# EAGLE schematic Telemetry Unit (EAGLE 9.4.2)

## Sheet 1 of 5: ATMega128 Microcontroller
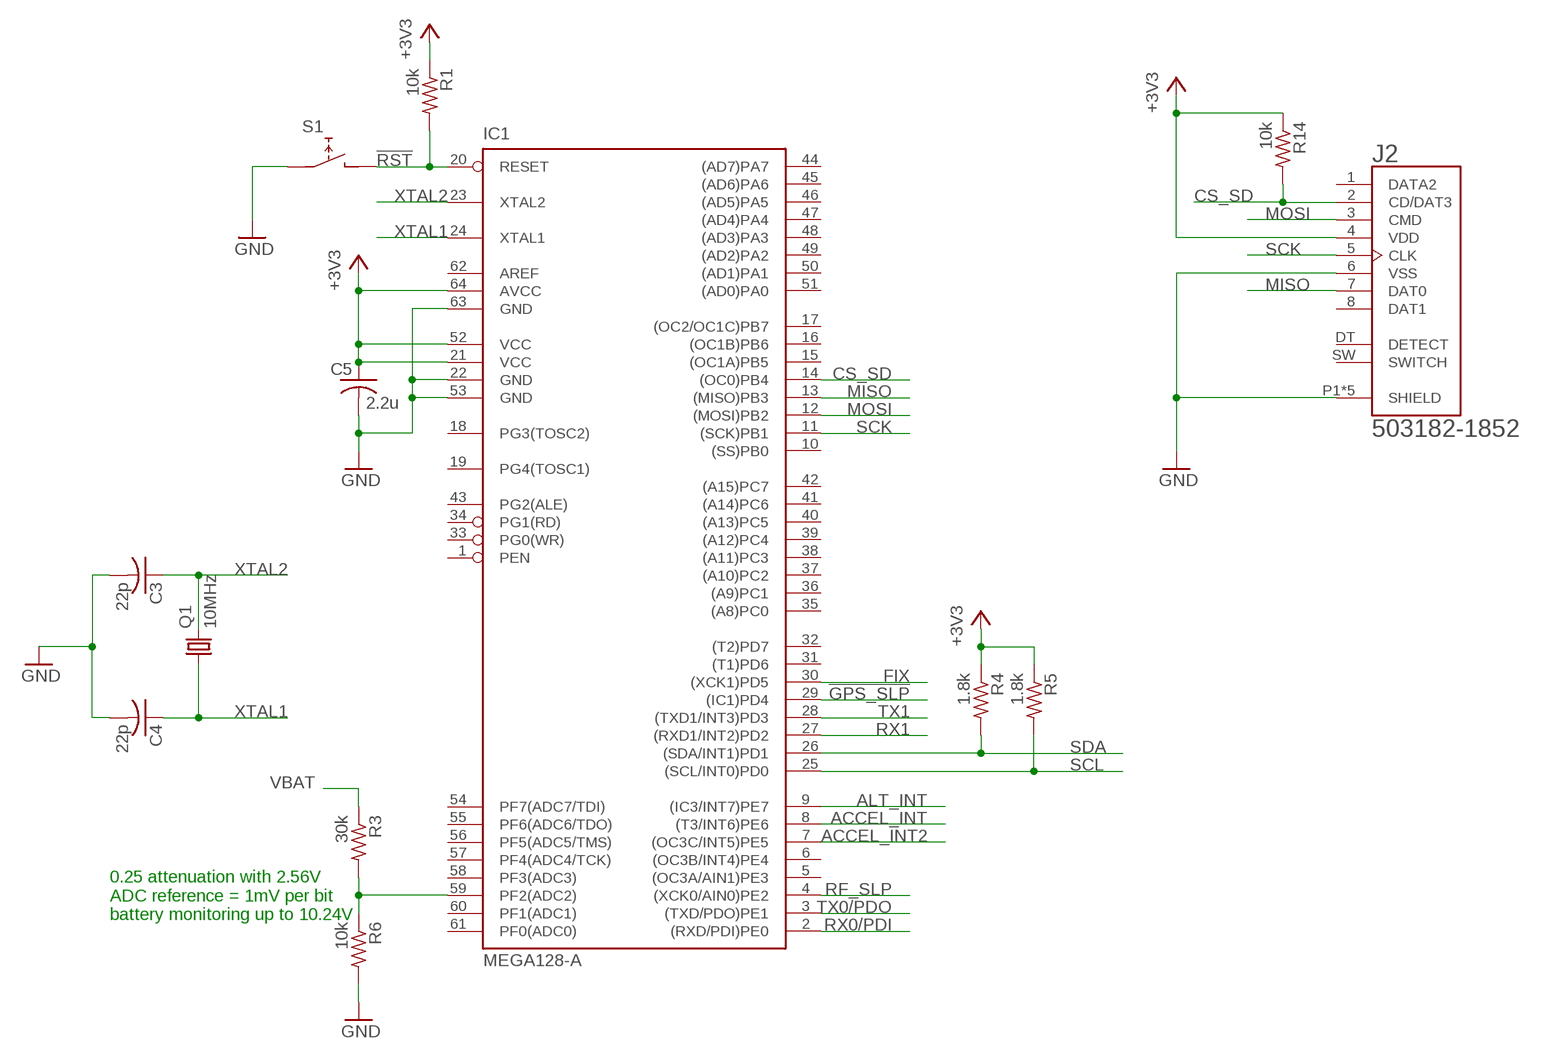
[diagram p0: schematic, sheet 1]

### Parts
C3  22p  C-USC0603  [C0603]
C4  22p  C-USC0603  [C0603]
C5  2.2u  C-USC0603  [C0603]
IC1  MEGA128-A  [TQFP64]
J2  503182-1852  [MOLEX_503182-1852]
Q1  10MHz  KX-7  [3.2X2.5_KX-7]
R1  10k  R-US_R0603  [R0603]
R3  30k  R-US_R0603  [R0603]
R4  1.8k  R-US_R0603  [R0603]
R5  1.8k  R-US_R0603  [R0603]
R6  10k  R-US_R0603  [R0603]
R14  10k  R-US_R0603  [R0603]
S1  TACT_SW_4.5MM  [TACT_SW_4.5MM]

### Nets
!GPS_SLP: IC1.29((IC1)PD4) ; also sheet 2
!RST: IC1.20(RESET) R1.2 S1.P2@1 S1.P2@2 ; also sheet 4
+3V3: C5.1 IC1.21(VCC) IC1.52(VCC) IC1.64(AVCC) J2.4(VDD) R1.1 R4.1 R5.1 R14.1 ; also sheet 2,3,4,5
ACCEL_INT: IC1.8((T3/INT6)PE6) ; also sheet 3
ACCEL_INT2: IC1.7((OC3C/INT5)PE5) ; also sheet 3
ALT_INT: IC1.9((IC3/INT7)PE7) ; also sheet 3
CS_SD: IC1.14((OC0)PB4) J2.2(CD/DAT3) R14.2
FIX: IC1.30((XCK1)PD5) ; also sheet 2
GND: C3.2 C4.2 C5.2 IC1.22(GND) IC1.53(GND) IC1.63(GND) J2.6(VSS) J2.P1(SHIELD) J2.P2(SHIELD) J2.P3(SHIELD) J2.P4(SHIELD) J2.P5(SHIELD) R6.2 S1.P1@1 S1.P1@2 ; also sheet 2,3,4,5
MISO: IC1.13((MISO)PB3) J2.7(DAT0)
MOSI: IC1.12((MOSI)PB2) J2.3(CMD)
N$5: IC1.59(PF2(ADC2)) R3.2 R6.1
RF_SLP: IC1.4((XCK0/AIN0)PE2) ; also sheet 4
RX0/PDI: IC1.2((RXD/PDI)PE0) ; also sheet 4
RX1: IC1.27((RXD1/INT2)PD2) ; also sheet 2
SCK: IC1.11((SCK)PB1) J2.5(CLK) ; also sheet 4
SCL: IC1.25((SCL/INT0)PD0) R5.2 ; also sheet 3
SDA: IC1.26((SDA/INT1)PD1) R4.2 ; also sheet 3
TX0/PDO: IC1.3((TXD/PDO)PE1) ; also sheet 4
TX1: IC1.28((TXD1/INT3)PD3) ; also sheet 2
VBAT: R3.1 ; also sheet 5
XTAL1: C4.1 IC1.24(XTAL1) Q1.1
XTAL2: C3.1 IC1.23(XTAL2) Q1.3
Unconnected: IC1.1(PEN) IC1.5((OC3A/AIN1)PE3) IC1.6((OC3B/INT4)PE4) IC1.10((SS)PB0) IC1.15((OC1A)PB5) IC1.16((OC1B)PB6) IC1.17((OC2/OC1C)PB7) IC1.18(PG3(TOSC2)) IC1.19(PG4(TOSC1)) IC1.31((T1)PD6) IC1.32((T2)PD7) IC1.33(PG0(WR)) IC1.34(PG1(RD)) IC1.35((A8)PC0) IC1.36((A9)PC1) IC1.37((A10)PC2) IC1.38((A11)PC3) IC1.39((A12)PC4) IC1.40((A13)PC5) IC1.41((A14)PC6) IC1.42((A15)PC7) IC1.43(PG2(ALE)) IC1.44((AD7)PA7) IC1.45((AD6)PA6) IC1.46((AD5)PA5) IC1.47((AD4)PA4) IC1.48((AD3)PA3) IC1.49((AD2)PA2) IC1.50((AD1)PA1) IC1.51((AD0)PA0) IC1.54(PF7(ADC7/TDI)) IC1.55(PF6(ADC6/TDO)) IC1.56(PF5(ADC5/TMS)) IC1.57(PF4(ADC4/TCK)) IC1.58(PF3(ADC3)) IC1.60(PF1(ADC1)) IC1.61(PF0(ADC0)) IC1.62(AREF) J2.1(DATA2) J2.8(DAT1) J2.DT(DETECT) J2.SW(SWITCH)

### Notes on the sheet
- 0.25 attenuation with 2.56V
  ADC reference = 1mV per bit
  battery monitoring up to 10.24V

## Sheet 2 of 5: GPS Module
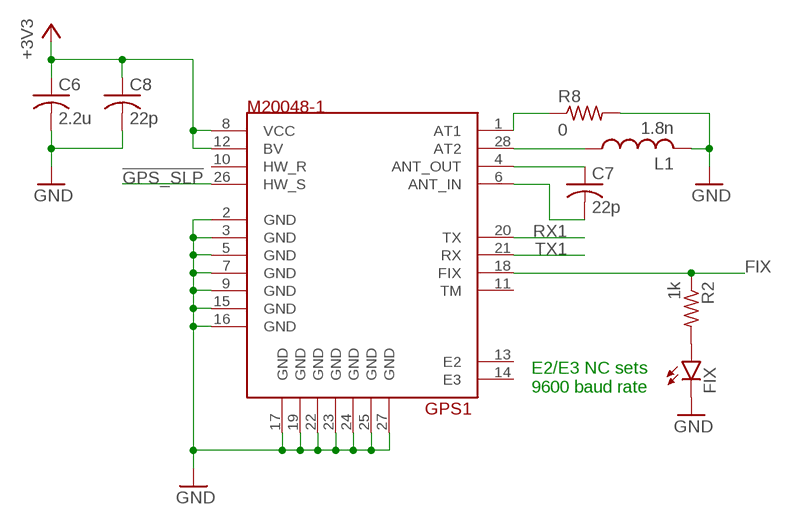
[diagram p1: schematic, sheet 2]

### Parts
C6  2.2u  C-USC0603  [C0603]
C7  22p  C-USC0603  [C0603]
C8  22p  C-USC0603  [C0603]
FIX  LEDCHIP-LED0603  [CHIP-LED0603]
GPS1  M20048-1  [M20048-1]
L1  1.8n  L_SMALLL0603  [L0603]
R2  1k  R-US_R0603  [R0603]
R8  0  R-US_R0603  [R0603]

### Nets
!GPS_SLP: GPS1.26(HW_S) ; also sheet 1
+3V3: C6.1 C8.1 GPS1.8(VCC) GPS1.12(BV) ; also sheet 1,3,4,5
FIX: GPS1.18(FIX) R2.1 ; also sheet 1
GND: C6.2 C8.2 FIX.C GPS1.2(GND) GPS1.3(GND) GPS1.5(GND) GPS1.7(GND) GPS1.9(GND) GPS1.15(GND) GPS1.16(GND) GPS1.17(GND) GPS1.19(GND) GPS1.22(GND) GPS1.23(GND) GPS1.24(GND) GPS1.25(GND) GPS1.27(GND) L1.2 R8.2 ; also sheet 1,3,4,5
N$1: C7.1 GPS1.4(ANT_OUT)
N$3: C7.2 GPS1.6(ANT_IN)
N$4: GPS1.28(AT2) L1.1
N$6: FIX.A R2.2
N$21: GPS1.1(AT1) R8.1
RX1: GPS1.20(TX) ; also sheet 1
TX1: GPS1.21(RX) ; also sheet 1
Unconnected: GPS1.10(HW_R) GPS1.11(TM) GPS1.13(E2) GPS1.14(E3)

### Notes on the sheet
- E2/E3 NC sets
  9600 baud rate

## Sheet 3 of 5: Misc Sensing
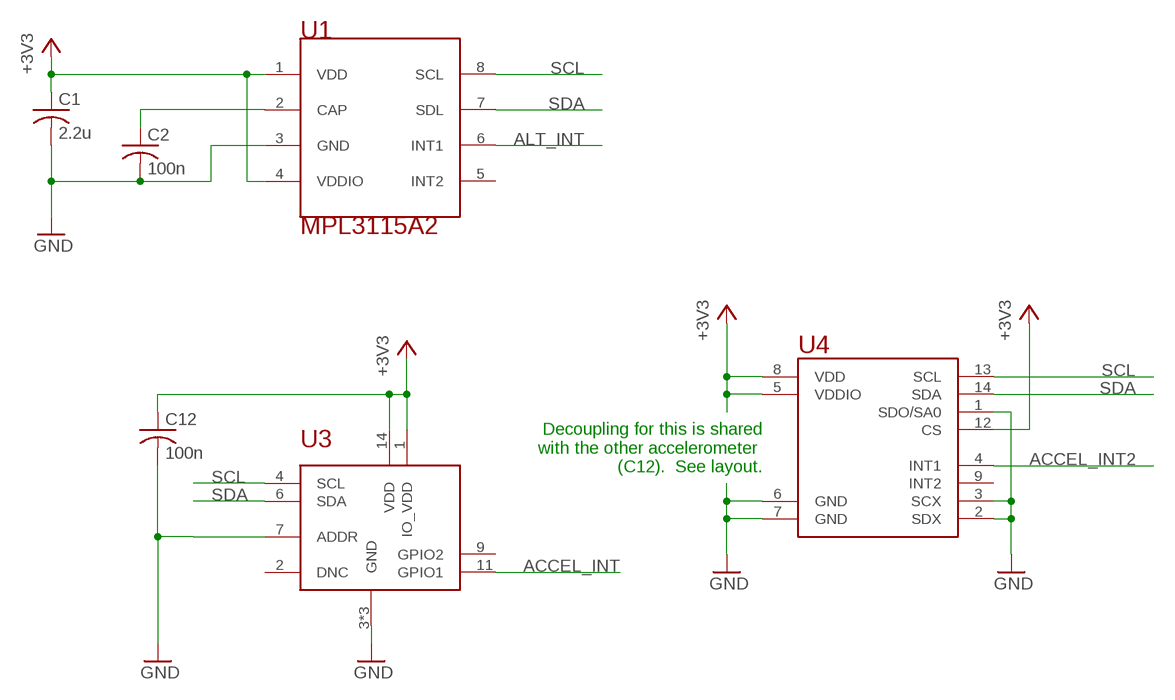
[diagram p2: schematic, sheet 3]

### Parts
C1  2.2u  C-USC0603  [C0603]
C2  100n  C-USC0603  [C0603]
C12  100n  C-USC0603  [C0603]
U1  MPL3115A2  [LGA8]
U3  KMX63-1055  [LGA16_3X3]
U4  LSM6DS3  [14-LGA]

### Nets
+3V3: C1.1 C12.1 U1.1(VDD) U1.4(VDDIO) U3.1(IO_VDD) U3.14(VDD) U4.5(VDDIO) U4.8(VDD) U4.12(CS) ; also sheet 1,2,4,5
ACCEL_INT: U3.11(GPIO1) ; also sheet 1
ACCEL_INT2: U4.4(INT1) ; also sheet 1
ALT_INT: U1.6(INT1) ; also sheet 1
GND: C1.2 C2.2 C12.2 U1.3(GND) U3.3(GND) U3.5(GND) U3.7(ADDR) U3.12(GND) U4.1(SDO/SA0) U4.2(SDX) U4.3(SCX) U4.6(GND) U4.7(GND) ; also sheet 1,2,4,5
N$2: C2.1 U1.2(CAP)
SCL: U1.8(SCL) U3.4(SCL) U4.13(SCL) ; also sheet 1
SDA: U1.7(SDL) U3.6(SDA) U4.14(SDA) ; also sheet 1
Unconnected: U1.5(INT2) U3.2(DNC) U3.9(GPIO2) U4.9(INT2)

### Notes on the sheet
- Decoupling for this is shared
  with the other accelerometer 
  (C12).  See layout.

## Sheet 4 of 5: XBee/Programmer
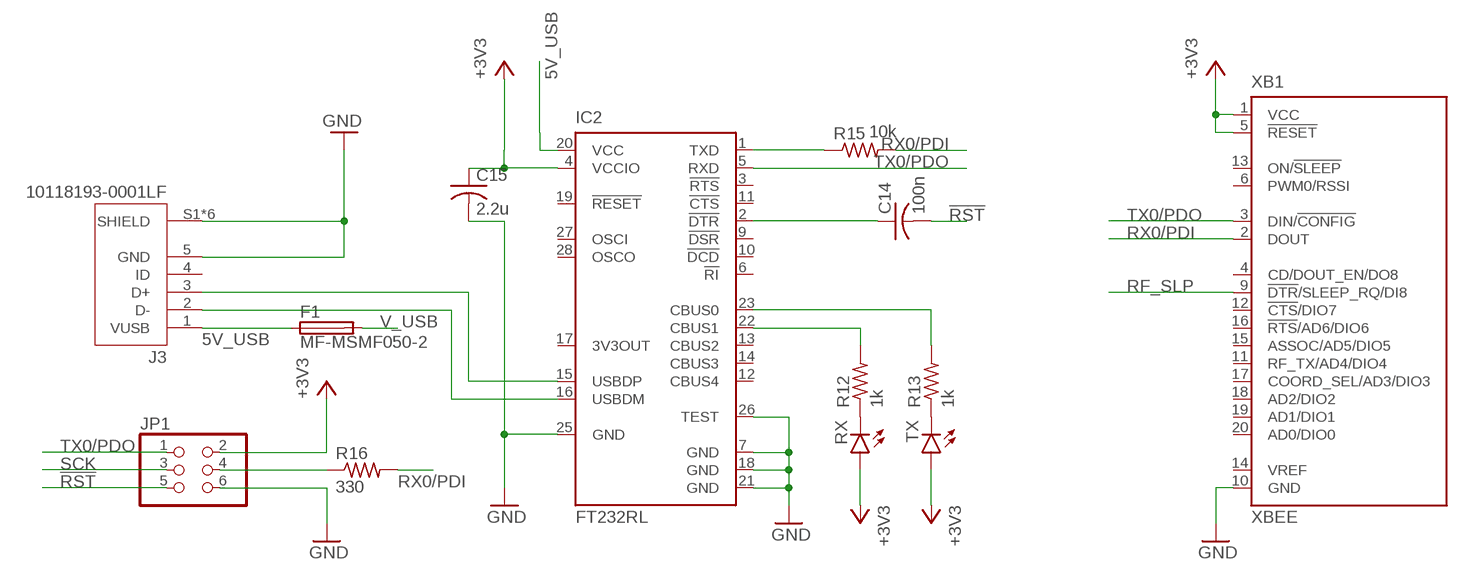
[diagram p3: schematic, sheet 4]

### Parts
C14  100n  C-USC0603  [C0603]
C15  2.2u  C-USC0603  [C0603]
F1  MF-MSMF050-2  [FUSM1812X02]
IC2  FT232RL  [SSOP28]
J3  10118193-0001LF  [FCI_10118193-0001LF]
JP1  PINHD-2X3  [2X03]
R12  1k  R-US_R0603  [R0603]
R13  1k  R-US_R0603  [R0603]
R15  10k  R-US_R0603  [R0603]
R16  330  R-US_R0603  [R0603]
RX  LEDCHIP-LED0603  [CHIP-LED0603]
TX  LEDCHIP-LED0603  [CHIP-LED0603]
XB1  XBEE  [XBEE]

### Nets
5V_USB: F1.1 IC2.20(VCC) J3.1(VUSB)
!RST: C14.2 JP1.5 ; also sheet 1
+3V3: C15.1 IC2.4(VCCIO) JP1.2 RX.A TX.A XB1.1(VCC) XB1.5(!RESET) ; also sheet 1,2,3,5
GND: C15.2 IC2.7(GND) IC2.18(GND) IC2.21(GND) IC2.25(GND) IC2.26(TEST) J3.5(GND) J3.S1(SHIELD) J3.S2(SHIELD) J3.S3(SHIELD) J3.S4(SHIELD) J3.S5(SHIELD) J3.S6(SHIELD) JP1.6 XB1.10(GND) ; also sheet 1,2,3,5
N$11: IC2.16(USBDM) J3.2(D-)
N$13: IC2.15(USBDP) J3.3(D+)
N$15: R12.1 RX.C
N$16: C14.1 IC2.2(!DTR)
N$17: R13.1 TX.C
N$18: IC2.22(CBUS1) R12.2
N$19: IC2.23(CBUS0) R13.2
N$20: IC2.1(TXD) R15.1
PDI: JP1.4 R16.1
RF_SLP: XB1.9(!DTR!/SLEEP_RQ/DI8) ; also sheet 1
RX0/PDI: R15.2 R16.2 XB1.2(DOUT) ; also sheet 1
SCK: JP1.3 ; also sheet 1
TX0/PDO: IC2.5(RXD) JP1.1 XB1.3(DIN/!CONFIG) ; also sheet 1
V_USB: F1.2 ; also sheet 5
Unconnected: IC2.3(!RTS) IC2.6(!RI) IC2.9(!DSR) IC2.10(!DCD) IC2.11(!CTS) IC2.12(CBUS4) IC2.13(CBUS2) IC2.14(CBUS3) IC2.17(3V3OUT) IC2.19(!RESET) IC2.27(OSCI) IC2.28(OSCO) J3.4(ID) XB1.4(CD/DOUT_EN/DO8) XB1.6(PWM0/RSSI) XB1.11(RF_TX/AD4/DIO4) XB1.12(!CTS!/DIO7) XB1.13(ON/!SLEEP) XB1.14(VREF) XB1.15(ASSOC/AD5/DIO5) XB1.16(!RTS!/AD6/DIO6) XB1.17(COORD_SEL/AD3/DIO3) XB1.18(AD2/DIO2) XB1.19(AD1/DIO1) XB1.20(AD0/DIO0)

## Sheet 5 of 5: Power Supply
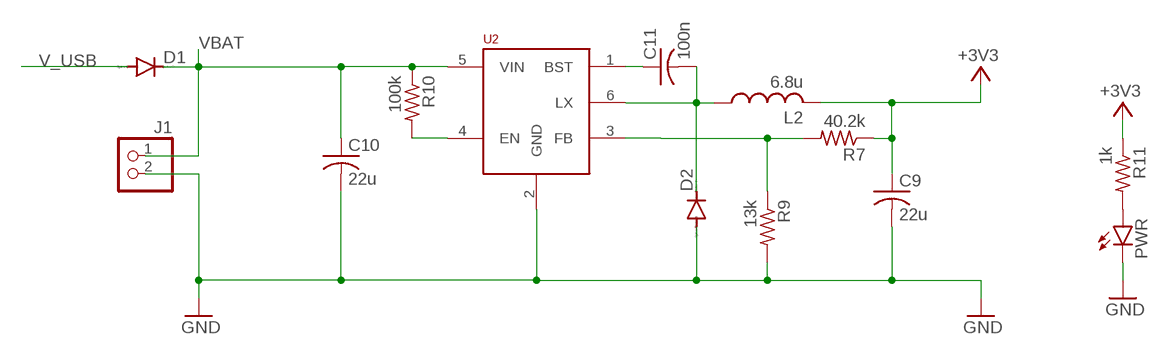
[diagram p4: schematic, sheet 5]

### Parts
C9  22u  C-USC0805  [C0805]
C10  22u  C-USC0805  [C0805]
C11  100n  C-USC0603  [C0603]
D1  DIODE-SOD123  [SOD123]
D2  DIODE-SOD123  [SOD123]
J1  ST_2X1  [ST_2X1]
L2  6.8u  L_SMALLL1210  [L1210]
PWR  LEDCHIP-LED0603  [CHIP-LED0603]
R7  40.2k  R-US_R0603  [R0603]
R9  13k  R-US_R0603  [R0603]
R10  100k  R-US_R0603  [R0603]
R11  1k  R-US_R0603  [R0603]
U2  AOZ1280  [TSOT23-6]

### Nets
+3V3: C9.1 L2.2 R7.1 R11.1 ; also sheet 1,2,3,4
GND: C9.2 C10.2 D2.A J1.2 PWR.C R9.2 U2.2(GND) ; also sheet 1,2,3,4
N$7: C11.2 D2.C L2.1 U2.6(LX)
N$9: R10.2 U2.4(EN)
N$10: R7.2 R9.1 U2.3(FB)
N$12: C11.1 U2.1(BST)
N$14: PWR.A R11.2
V_USB: D1.A ; also sheet 4
VBAT: C10.1 D1.C J1.1 R10.1 U2.5(VIN) ; also sheet 1

## Library data of the parts
C1-C12 C14 C15 = resistor:C-US: CAPACITOR, American symbol
D1 D2 = diode:DIODE-: DIODE
F1 = MF-MSMF050-2:MF-MSMF050-2: PTC Resettable Fuse 0.5A(hold) 1A(trip) 15V 100A 0.8W 0.15s 0.15Ohm SMD Solder Pad 1812 T/R; AVAILABILITY: Unavailable; DESCRIPTION: PTC Resettable Fuse 0.5A_hold_ 1A_trip_ 15V 100A 0.8W 0.15s 0.15Ohm SMD Solder Pad 1812 T/R; MF: Bourns; MP: MF-MSMF050-2; PACKAGE: 1812 Bourns; PRICE: None
FIX PWR RX TX = led:LED: LED OSRAM: - CHIPLED LG R971, LG N971, LY N971, LG Q971, LY Q971, LO R971, LY R971 LH N974, LH R974 LS Q976, LO Q976, LY Q976 LO Q996 - Hyper CHIPLED LW Q18S LB Q993, LB Q99A, LB R99A - SideLED LS A670, LO A670, LY A670, LG A670, LP A670 LB A673, LV A673, LT A673, LW A673 LH A674 LY A675 LS A676, LA A676, LO A676, LY A676, LW A676 LS A679, LY A679, LG A679 - Hyper Micro SIDELED® LS Y876, LA Y876, LO Y876, LY Y876 LT Y87S - SmartLED LW L88C, LW L88S LB L89C, LB L89S, LG L890 LS L89K, LO L89K, LY L89K LS L896, LA L896, LO L896, LY L896 - TOPLED LS T670, LO T670, LY T670, LG T670, LP T670 LSG T670, LSP T670, LSY T670, LOP T670, LYG T670 LG T671, LOG T671, LSG T671 LB T673, LV T673, LT T673, LW T673 LH T674 LS T676, LA T676, LO T676, LY T676, LB T676, LH T676, LSB T676, LW T676 LB T67C, LV T67C, LT T67C, LS T67K, LO T67K, LY T67K, LW E67C LS E67B, LA E67B, LO E67B, LY E67B, LB E67C, LV E67C, LT E67C LW T67C LS T679, LY T679, LG T679 LS T770, LO T770, LY T770, LG T770, LP T770 LB T773, LV T773, LT T773, LW T773 LH T774 LS E675, LA E675, LY E675, LS T675 LS T776, LA T776, LO T776, LY T776, LB T776 LHGB T686 LT T68C, LB T68C - Hyper Mini TOPLED® LB M676 - Mini TOPLED Santana® LG M470 LS M47K, LO M47K, LY M47K Source: http://www.osram.convergy.de LUXEON: - LUMILED® LXK2-PW12-R00, LXK2-PW12-S00, LXK2-PW14-U00, LXK2-PW14-V00 LXK2-PM12-R00, LXK2-PM12-S00, LXK2-PM14-U00 LXK2-PE12-Q00, LXK2-PE12-R00, LXK2-PE12-S00, LXK2-PE14-T00, LXK2-PE14-U00 LXK2-PB12-K00, LXK2-PB12-L00, LXK2-PB12-M00, LXK2-PB14-N00, LXK2-PB14-P00, LXK2-PB14-Q00 LXK2-PR12-L00, LXK2-PR12-M00, LXK2-PR14-Q00, LXK2-PR14-R00 LXK2-PD12-Q00, LXK2-PD12-R00, LXK2-PD12-S00 LXK2-PH12-R00, LXK2-PH12-S00 LXK2-PL12-P00, LXK2-PL12-Q00, LXK2-PL12-R00 Source: www.luxeon.com KINGBRIGHT: KA-3528ASYC Source: www.kingbright.com
GPS1 = TrackerPeripherals:M20048-1
IC1 = atmel:MEGA128: MICROCONTROLLER 128 Kbytes FLASH 4 Kbytes SRAM 4 Kbytes EEPROM DUAL USART 8-channel 10 bit ADC Source: avr.lbr; MPN: ATMEGA128-16AU; OC_FARNELL: 9171118; OC_NEWARK: 95K7364
IC2 = ftdichip:FT232R: Source: http://www.ftdichip.com/Documents/DataSheets/DS_FT232R_v104.pdf; MPN: FT232RL; OC_FARNELL: 1146032; OC_NEWARK: 91K9918
J1 = TrackerPeripherals:ST_2X1
J2 = 503182-1852_SD:503182-1852: Conn Micro SD Card M 8 POS 1.09mm Solder RA SMD Embossed T/R 0.5A/Contact; DESCRIPTION: MICRO SD NORMAL ULTRALOWPRO8CKTE; DIGI-KEY_PART_NUMBER: WM12834CT-ND; DIGI-KEY_PURCHASE_URL: https://www.digikey.com/product-detail/en/molex/5031821852/WM12834CT-ND/5823232?utm_source=snapeda&utm_medium=aggregator&utm_campaign=symbol; MF: Molex, LLC; MP: 5031821852; PACKAGE: None
J3 = 10118193-0001LF_microUSB:10118193-0001LF: Micro USB B Type Receptacle; DESCRIPTION: Conn Micro USB Type B RCP 5 POS 0.65mm Solder RA SMD 5 Terminal 1 Port T/R; DIGI-KEY_PART_NUMBER: 609-4616-1-ND; DIGI-KEY_PURCHASE_URL: https://www.digikey.com/product-detail/en/amphenol-icc-fci/10118193-0001LF/609-4616-1-ND/2785380?utm_source=snapeda&utm_medium=aggregator&utm_campaign=symbol; MF: Amphenol ICC; MP: 10118193-0001LF; PACKAGE: None
JP1 = pinhead:PINHD-2X3: PIN HEADER
L1 L2 = TrackerPeripherals:L_SMALL
Q1 = crystal-geyer_V1_0:KX: Quartz Crystals (MHz) SMD: KX - Serie Model Size l/w/h [mm] Frequency Range Frequency Stability Temp. Range [°C] Load Capacitance AECQ 200 availabel Datasheet KX-4 KX-5 KX-6 KX-7 KX-9A KX-9B KX-12A KX-12B KX-13 KX-20 KX-K KX-KS 1.6/1.2/0.3 2.0/1.6/0.45 2.5/2.0/0.55 3.2/2.5/0.8 5.0/3.2/1.0 5.0/3.2/1.1 6.0/3.5/1.1 6.0/3.5/1.0 7.0/5.0 /1.3 11.6/5.5/1.6 12.3/4.5/4.2 12.3/4.5/3.2 24.0 ~ 80.0 MHz 16.0 ~ 80.0 MHz 12.0 ~ 80.0 MHz 8.0 ~ 60.0 MHz 7,68 ~ 300,0 MHz 8,0 ~ 50,0 MHz 8,0 ~ 150,0 MHz 8,0 ~ 50,0 MHz 6,0 ~ 160,0 MHz 3,579 ~ 25,0 MHz 3,579 ~ 70,0 MHz 3,579 ~ 70,0 MHz ±10 … ±50ppm ±10 … ±50ppm ±10 … ±50ppm ±10 … ±50ppm ±10 … ±50ppm ±10 … ±50ppm ±10 … ±50ppm ±10 … ±50ppm ±10 … ±50ppm ±50ppm ±10 … ±50ppm ±10 … ±50ppm (*) -40°C …+85°C (*) -40°C …+125°C (*) -40°C …+125°C (*) -40°C …+125°C (*) -40°C …+105°C (*) -40°C …+105°C (*) -40°C …+125°C (*) -40°C …+105°C (*) -40°C …+105°C (*) -40°C …+105°C (*) -40°C …+85°C (*) -40°C …+85°C 8, 8…16 8, 8…16 10, 8…16 12, 7…20 16, 10…20 16, 10…20 16, 10…20 16, 12…20 16, 12…20 16, 12…20 16, 12…30 16, 12…30 - yes yes yes - - - - - - - - KX-4.pdf <http://www.geyer-electronic.de/uploads/tx_userartikelfrequenz/GEYER-KX-4.pdf> KX-5.pdf <http://www.geyer-electronic.de/uploads/tx_userartikelfrequenz/GEYER-KX-5.pdf> KX-6.pdf <http://www.geyer-electronic.de/uploads/tx_userartikelfrequenz/GEYER-KX-6.pdf> KX-7.pdf <http://www.geyer-electronic.de/uploads/tx_userartikelfrequenz/GEYER-KX-7.pdf> KX-9A.pdf <http://www.geyer-electronic.de/uploads/tx_userartikelfrequenz/GEYER-KX-9A.pdf> KX-9B.pdf <http://www.geyer-electronic.de/uploads/tx_userartikelfrequenz/GEYER-KX-9B.pdf> KX-12A.pdf <http://www.geyer-electronic.de/uploads/tx_userartikelfrequenz/GEYER-KX-12A.pdf> KX-12B.pdf <http://www.geyer-electronic.de/uploads/tx_userartikelfrequenz/GEYER-KX-12B.pdf> KX-13.pdf <http://www.geyer-electronic.de/uploads/tx_userartikelfrequenz/GEYER-KX-13.pdf> KX-20.pdf <http://www.geyer-electronic.de/uploads/tx_userartikelfrequenz/GEYER-KX-20.pdf> KX-K.pdf <http://www.geyer-electronic.de/uploads/tx_userartikelfrequenz/GEYER-KX-K.pdf> KX-KS.pdf <http://www.geyer-electronic.de/uploads/tx_userartikelfrequenz/GEYER-KX-KS.pdf> <http://www.geyer-electronic.de/fileadmin/template/img/logo-geyer-electronic.png> Details see: http://www.geyer-electronic.de/Frequenz-Produkte.9.0.html Created 2016-06-07, Hans Locher 2016 (C) Geyer Quartz Technology KX4,KX5,KX6,KX7,KX9A,KX9B,KX12A,KX12B,KX13,KX20,KXK,KXKS;1612;2016;2520;3225;5032;6035;7050;11655;12345;1,6x1,2;2,0x1,6;2,5x2,0;3,2x2,5;5,0x3,2;6,0x3,5;7,0x5,0;11,6x5,5;12,3x4,5;12,3x4,5;1.6x1.2;2.0x1.6;2.5x2.0;3.2x2.5;5.0x3.2;6.0x3.5;7.0x5.0;11.6x5.5;12.3x4.5;12.3x4.5;
R1-R11 R14-R16 = resistor:R-US_: RESISTOR, American symbol
R12 R13 = rcl:R-US_: RESISTOR, American symbol; SPICEPREFIX: R
S1 = TrackerPeripherals:TACT_SW_4.5MM
U1 = TrackerPeripherals:MPL3115A2
U2 = TrackerPeripherals:AOZ1280
U3 = TrackerPeripherals:KMX63-1055
U4 = TrackerPeripherals:LSM6DS3
XB1 = TrackerPeripherals:XBEE: XBee (TM) /XBee-PRO(TM) OEM RF Modules Source: MaxStream, Inc. xbee_productmanual.pdf; MPN: XBP24-Z7UIT-004; OC_FARNELL: 1751799; OC_NEWARK: 34R5507